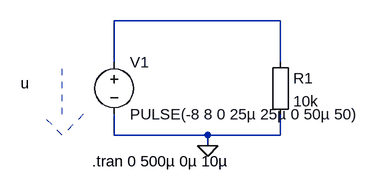
[diagram p0: schematic Versuch 2 Schaltung 2.asc]
Versuch 2 Schaltung 2.asc, the LTspice schematic file:
Version 4
SHEET 1 880 680
WIRE 320 64 64 64
WIRE 64 128 64 64
WIRE 320 128 320 64
WIRE 64 240 64 208
WIRE 208 240 64 240
WIRE 320 240 320 208
WIRE 320 240 208 240
WIRE 208 256 208 240
FLAG 208 256 0
SYMBOL Misc\\EuropeanResistor 304 112 R0
SYMATTR InstName R1
SYMATTR Value 10k
SYMBOL voltage 64 112 R0
WINDOW 123 0 0 Left 0
WINDOW 39 0 0 Left 0
SYMATTR InstName V1
SYMATTR Value PULSE(-8 8 0 25µ 25µ 0 50µ 50)
TEXT 30 280 Left 2 !.tran 0 500µ 0µ 10µ
TEXT -80 160 Left 2 !u
LINE Normal -16 208 -16 128 2
LINE Normal -16 240 -48 208 2
LINE Normal 16 208 -16 240 2

The netlist it stands for:
* Versuch 2 Schaltung 2.asc
R1 N001 0 10k
V1 N001 0 PULSE(-8 8 0 25µ 25µ 0 50µ 50)
.tran 0 500µ 0µ 10µ
u
.backanno
.end